# Altium schematic sheet HyperRAM.SchDoc: HyperRAM
size A4; CompanyName: STMicroelectronics; Organization: Microcontrollers Division; DocumentNumber: 14; SheetNumber: 10; SheetTotal: 19
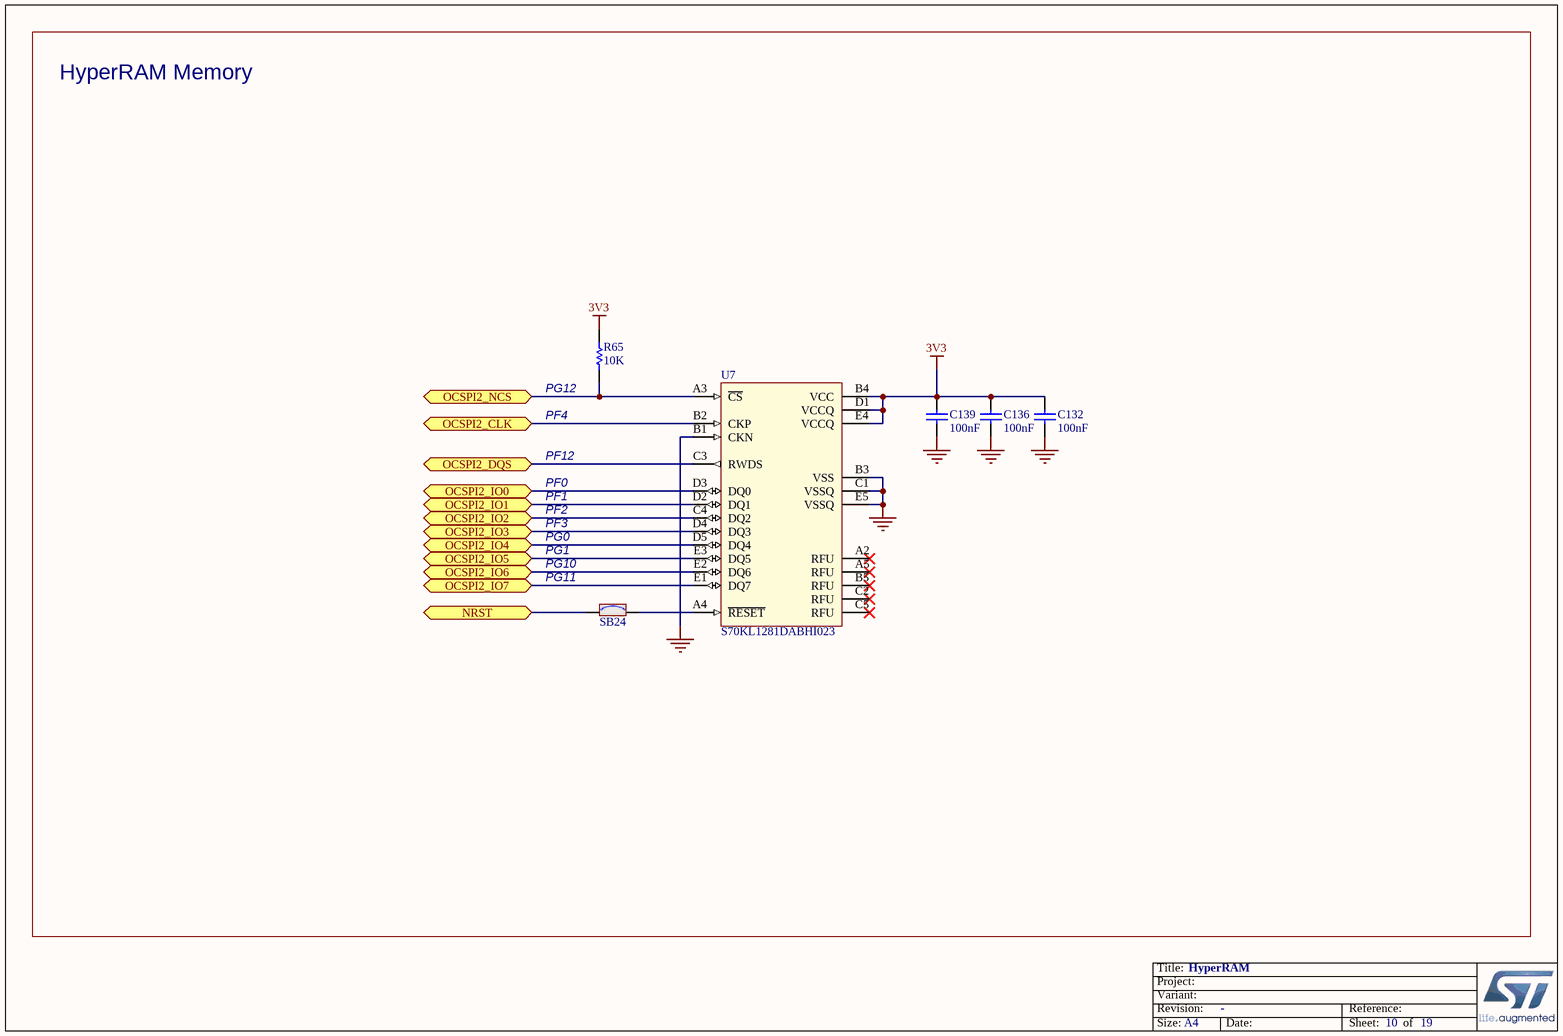
[diagram p0: HyperRAM.SchDoc]

## Parts
C132  value 100nF  [C0402]  (hidden comment: Capacitor)
C136  value 100nF  [C0402]  (hidden comment: Capacitor)
C139  value 100nF  [C0402]  (hidden comment: Capacitor)
R65  value 10K  [R0402]  (hidden comment: Resistor)
SB24  SB_ON  [SOLDER-BRIDGE_R0603-0R]  (value not drawn)
U7  S70KL1281DABHI023  [ICC_FBGA24_5X5-BALL-ARRAY_6X8_P1]

## Ports
NRST (bidir), OCSPI2_CLK (bidir), OCSPI2_DQS (bidir), OCSPI2_IO0 (bidir), OCSPI2_IO1 (bidir), OCSPI2_IO2 (bidir), OCSPI2_IO3 (bidir), OCSPI2_IO4 (bidir), OCSPI2_IO5 (bidir), OCSPI2_IO6 (bidir), OCSPI2_IO7 (bidir), OCSPI2_NCS (bidir)

## Nets
3V3: C132.2 C136.2 C139.2 R65.2 U7.B4(VCC) U7.D1(VCCQ) U7.E4(VCCQ)
GND: C132.1 C136.1 C139.1 U7.B1(CKN) U7.B3(VSS) U7.C1(VSSQ) U7.E5(VSSQ)
NRST: SB24.1 ; port NRST
OCSPI2_CLK: U7.B2(CKP) ; port OCSPI2_CLK
OCSPI2_DQS: U7.C3(RWDS) ; port OCSPI2_DQS
OCSPI2_IO0: U7.D3(DQ0) ; port OCSPI2_IO0
OCSPI2_IO1: U7.D2(DQ1) ; port OCSPI2_IO1
OCSPI2_IO2: U7.C4(DQ2) ; port OCSPI2_IO2
OCSPI2_IO3: U7.D4(DQ3) ; port OCSPI2_IO3
OCSPI2_IO4: U7.D5(DQ4) ; port OCSPI2_IO4
OCSPI2_IO5: U7.E3(DQ5) ; port OCSPI2_IO5
OCSPI2_IO6: U7.E2(DQ6) ; port OCSPI2_IO6
OCSPI2_IO7: U7.E1(DQ7) ; port OCSPI2_IO7
OCSPI2_NCS: R65.1 U7.A3(~{CS}) ; port OCSPI2_NCS
NetSB24_2: SB24.2 U7.A4(~{RESET})

Not connected (* = marked no-connect by the designer): U7 A2(RFU)* A5(RFU)* B5(RFU)* C2(RFU)* C5(RFU)*

## Notes on the sheet
- HyperRAM Memory
- (near R65) PG12
- PF4
- PF12
- PF0
- PF1
- PF2
- PF3
- PG0
- PG1
- (near SB24) PG10
- (near SB24) PG11
- Title:
- Project:
- Size:
- Revision:
- Variant:
- A4
- -
- Date:
- Reference:
- Sheet:
- of

## Library data of the parts
C132 C136 C139 = MCD-00102: Capacitor, MLCC, 100nF, 16V, X7R, 10%, 0402, T=0,5mm; Manufacturer_Part_Number: CC0402KRX7R7BB104; Manufacturer: YAGEO; Alternate_Manufacturer_Part_Number: GCM155R71C104KA55D; Alternate_Manufacturer: MURATA; ECCN_US: EAR99; ECCN_EU: NEC; Provided_By: SUBCO; Internal_Part_Number: MCD-00102; Status: Released; Part_Type: Capacitor; Package: C0402; ComponentLink1Description: Datasheet; ComponentLink1URL: http://tunmcdsvn.tun.st.com/Component_Datasheet_Library/Trunk/Capacitors/Yageo_Multilayer_Capacitor_X7R_series_100pF_to_22uF
R65 = MCD-00053: Resistor,10K,0402,1%,1/16W; Manufacturer_Part_Number: RC0402FR-0710KL; Manufacturer: YAGEO; ECCN_US: EAR99; ECCN_EU: NEC; Provided_By: SUBCO; Internal_Part_Number: MCD-00053; Status: Released; Part_Type: Resistor; Package: R0402; ComponentLink1Description: Datasheet; ComponentLink1URL: http://tunmcdsvn.tun.st.com/Component_Datasheet_Library/Trunk/Resistors/Yageo_Resistor_RC0402-series
SB24 = MCD-00071: Solder Bridge ON; Part_Type: Mechanical; Manufacturer_Part_Number: RC0603JR-070RL; Manufacturer: YAGEO; Provided_By: SUBCO; Internal_Part_Number: MCD-00071; Status: Released; Package: SB0603; ComponentLink1Description: Datasheet; ComponentLink1URL: http://tunmcdsvn.tun.st.com/Component_Datasheet_Library/Trunk/Resistors/Yageo_Resistor_RC0603-series; ECCN_US: n/a; ECCN_EU: n/a
U7 = MCD-01824: Memory, HyperRAM,128Mb,100MHz,3V,BGA24; Part_Type: IC; Manufacturer: CYPRESS; Provided_By: SUBCO; Internal_Part_Number: MCD-01824; Status: Checked; Manufacturer_Part_Number: S70KL1281DABHI023; Package: FBGA24; ComponentLink1Description: Datasheet; ComponentLink1URL: http://tunmcdsvn.tun.st.com/Component_Datasheet_Library/Trunk/IC/Cypress_HyperRAM_S70KL1281DABHI023/Cypress_HyperRAM_S70KL1281DABHI023.pdf; ECCN_US: n/a; ECCN_EU: n/a; Value: S70KL1281DABHI023